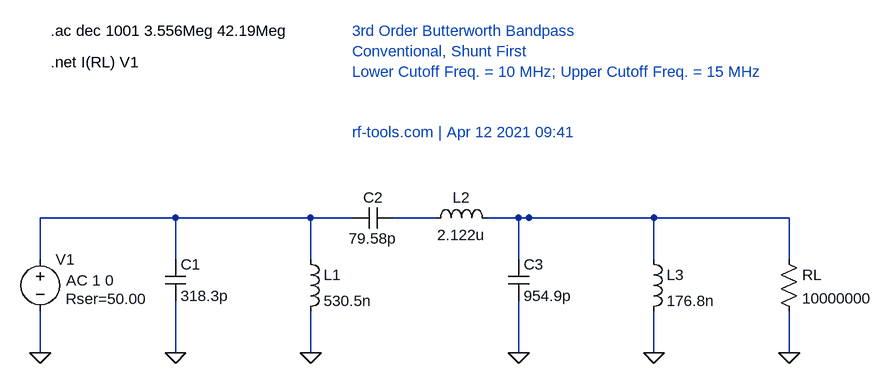
[diagram p0: schematic Bandpass filter original range exact value.asc]
Bandpass filter original range exact value.asc, the LTspice schematic file:
Version 4
SHEET 1 1200 400
WIRE 0 0 0 64
WIRE 0 144 0 208
WIRE 0 0 208 0
WIRE 208 0 208 64
WIRE 208 128 208 208
WIRE 208 0 416 0
WIRE 416 0 416 64
WIRE 416 144 416 208
WIRE 416 0 480 0
WIRE 544 0 608 0
WIRE 688 0 752 0
WIRE 736 0 736 64
WIRE 736 128 736 208
WIRE 736 0 944 0
WIRE 944 0 944 64
WIRE 944 144 944 208
WIRE 944 0 1152 0
WIRE 1152 0 1152 64
WIRE 1152 144 1152 208
FLAG 0 208 0
FLAG 208 208 0
FLAG 416 208 0
FLAG 736 208 0
FLAG 944 208 0
FLAG 1152 208 0
SYMBOL voltage 0 48 R0
WINDOW 123 40 48 Left 2
WINDOW 39 39 77 Left 2
SYMATTR InstName V1
SYMATTR Value ""
SYMATTR Value2 AC 1 0
SYMATTR SpiceLine Rser=50.00
SYMBOL cap 192 64 R0
SYMATTR InstName C1
SYMATTR Value 318.3p
SYMBOL ind 400 48 R0
SYMATTR InstName L1
SYMATTR Value 530.5n
SYMBOL cap 480 16 R270
SYMATTR InstName C2
SYMATTR Value 79.58p
WINDOW 0 32 32 VTop 2
WINDOW 3 0 32 VBottom 2
SYMBOL ind 592 16 R270
SYMATTR InstName L2
SYMATTR Value 2.122u
WINDOW 0 32 56 VTop 2
WINDOW 3 5 56 VBottom 2
SYMBOL cap 720 64 R0
SYMATTR InstName C3
SYMATTR Value 954.9p
SYMBOL ind 928 48 R0
SYMATTR InstName L3
SYMATTR Value 176.8n
SYMBOL res 1136 48 R0
SYMATTR InstName RL
SYMATTR Value 10000000
TEXT 16 -288 Left 2 !.ac dec 1001 3.556Meg 42.19Meg
TEXT 16 -240 Left 2 !.net I(RL) V1
TEXT 480 -288 Left 2 ;3rd Order Butterworth Bandpass\nConventional, Shunt First\nLower Cutoff Freq. = 10 MHz; Upper Cutoff Freq. = 15 MHz\n\n\nrf-tools.com | Apr 12 2021 09:41

The netlist it stands for:
* Bandpass filter original range exact value.asc
V1 N001 0 AC 1 0 Rser=50.00
C1 N001 0 318.3p
L1 N001 0 530.5n
C2 N001 N002 79.58p
L2 N002 N003 2.122u
C3 N003 0 954.9p
L3 N003 0 176.8n
RL N003 0 10000000
.ac dec 1001 3.556Meg 42.19Meg
.net I(RL) V1
* 3rd Order Butterworth Bandpass
* Conventional, Shunt First
* Lower Cutoff Freq. = 10 MHz; Upper Cutoff Freq. = 15 MHz
* rf-tools.com | Apr 12 2021 09:41
.backanno
.end